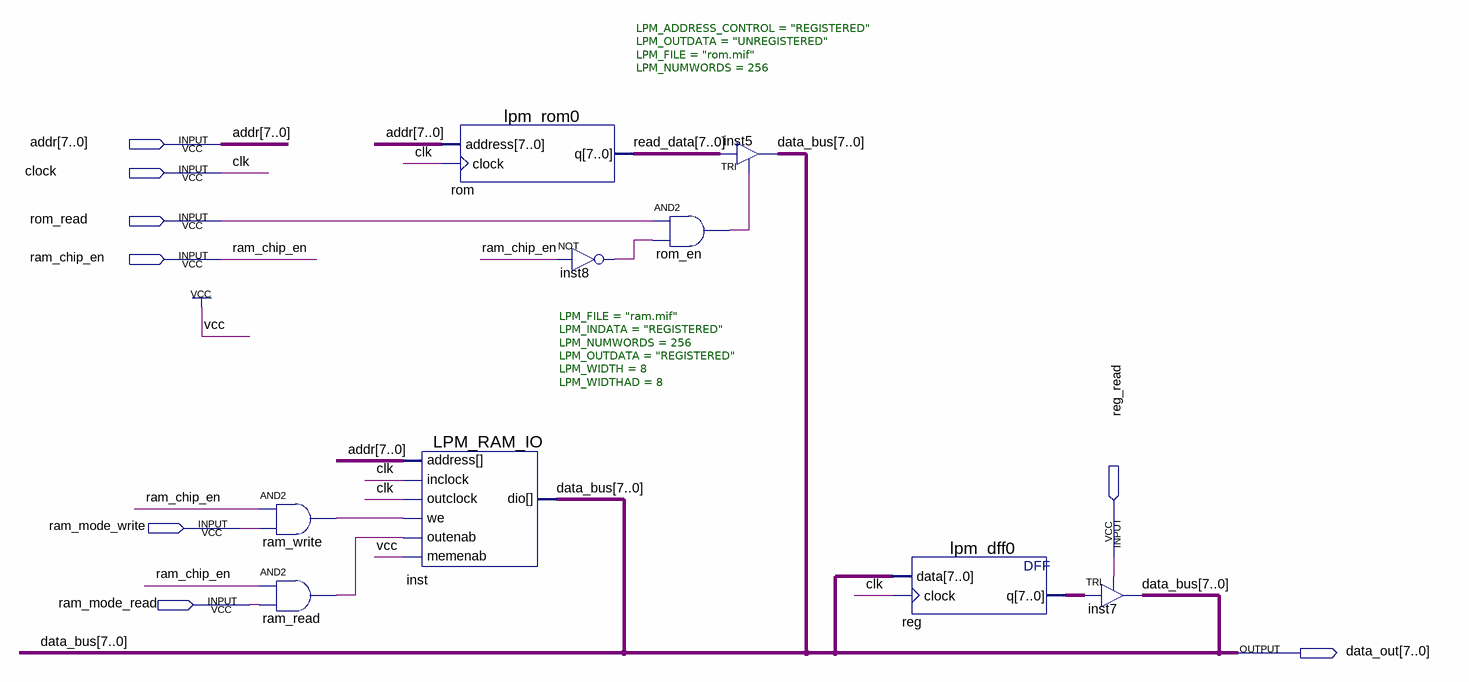
[diagram p0: schematic sheet]
// Quartus schematic lab3-2.bdf as structural Verilog: 9 symbols, 8 pins
module \lab3-2  (
  input  [7:0] addr,
  input  clock,
  input  rom_read,
  input  ram_chip_en,
  input  ram_mode_write,
  input  reg_read,
  input  ram_mode_read,
  output [7:0] data_out
);

  wire inst8_out, ram_read_out, ram_write_out, rom_en_out;
  wire [7:0] read_data, reg_q;

  and ram_write (ram_write_out, ram_chip_en, ram_mode_write);
  and ram_read (ram_read_out, ram_chip_en, ram_mode_read);
  lpm_rom0 #(.LPM_ADDRESS_CONTROL("REGISTERED"), .LPM_OUTDATA("UNREGISTERED"), .LPM_FILE("rom.mif"), .LPM_NUMWORDS(256)) rom (
    .address(addr), .clock(clock), .q(read_data));
  LPM_RAM_IO #(.LPM_FILE("ram.mif"), .LPM_INDATA("REGISTERED"), .LPM_NUMWORDS(256), .LPM_OUTDATA("REGISTERED"), .LPM_WIDTH(8), .LPM_WIDTHAD(8)) inst (
    .address(addr), .outclock(clock), .memenab(1'b1), .inclock(clock), .we(ram_write_out),
    .outenab(ram_read_out), .dio(data_out));
  not inst8 (inst8_out, ram_chip_en);
  and rom_en (rom_en_out, rom_read, inst8_out);
  TRI inst5[7:0] (.IN(read_data), .OE(rom_en_out), .OUT(data_out));
  lpm_dff0 \reg  (.data(data_out), .clock(clock), .q(reg_q));
  TRI inst7[7:0] (.IN(reg_q), .OE(reg_read), .OUT(data_out));

  // Other names for the same wires on the sheet: clk = clock; data_bus[7:0] = data_out
endmodule
